# EAGLE design Zio LRA Eval Board V1.0 (EAGLE 9.1.1)
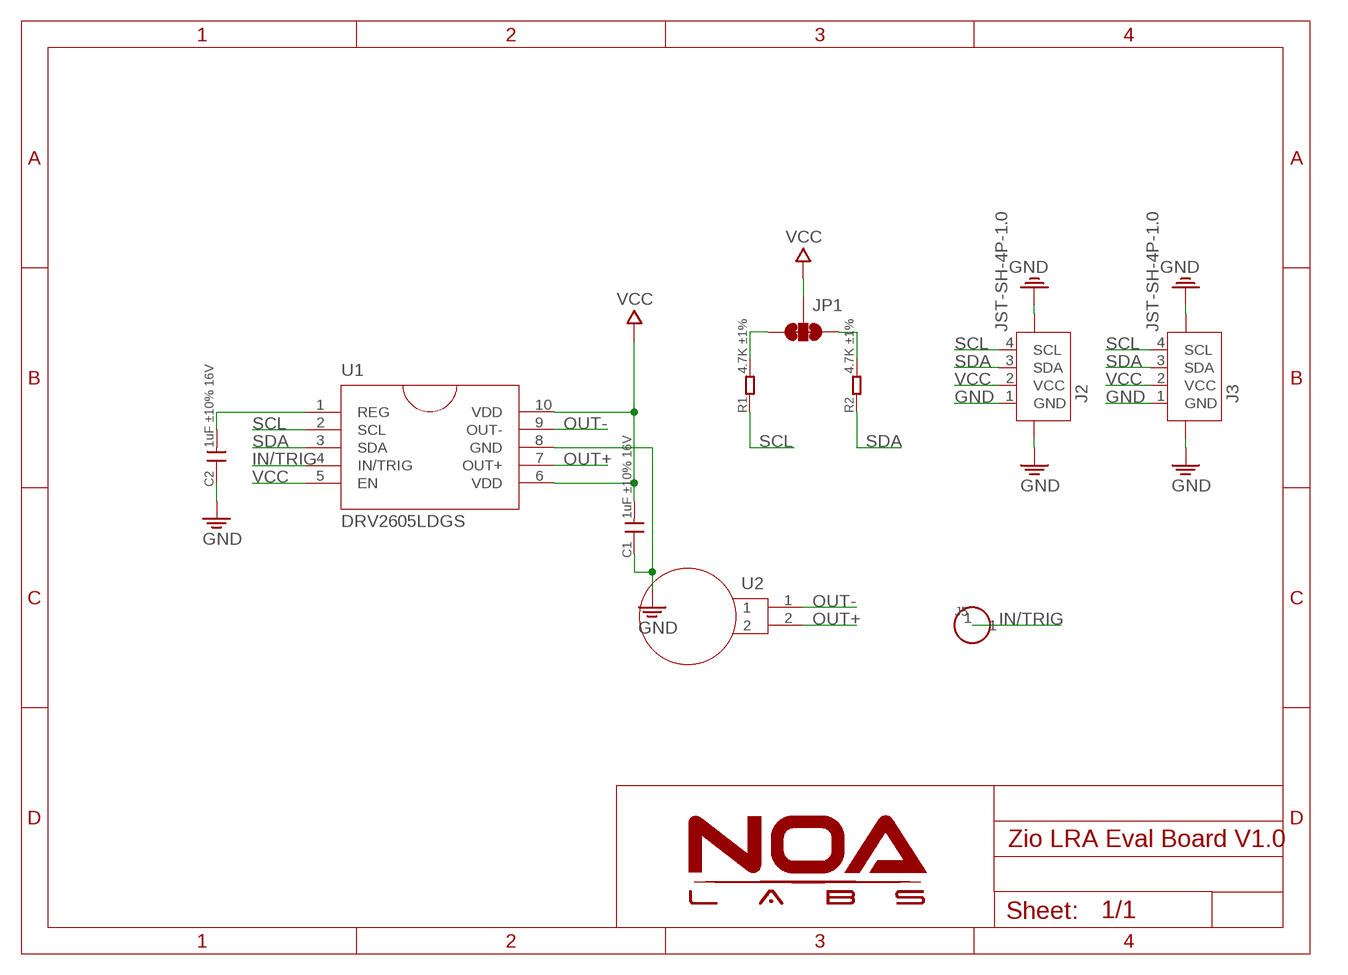
[diagram p0: schematic, sheet 1]

## Parts
C1  1uF ±10% 16V  C-0603  [C0603]
C2  1uF ±10% 16V  C-0603  [C0603]
J2  JST-SH-4P-1.0  [JST-SH-4P]
J3  JST-SH-4P-1.0  [JST-SH-4P]
J5  HEADER-1P  [1P-40MIL]
JP1  SMT-JUMPER_3_2-NC_TRACE  [SMT-JUMPER_3_2-NC_TRACE]
R1  4.7K ±1%  R-0402  [R0402]
R2  4.7K ±1%  R-0402  [R0402]
U1  DRV2605LDGS  DRV2605L  [VSSOP10]
U2  LRA-MOTOR-081230B  [LRA-MOTOR-081230B]

## Nets
GND: C1.1 C2.1 J2.1(GND) J2.NC1 J2.NC2 J3.1(GND) J3.NC1 J3.NC2 U1.8(GND)
IN/TRIG: J5.1 U1.4(IN/TRIG)
N$3: C2.2 U1.1(REG)
N$6: JP1.3 R1.2
N$8: JP1.1 R2.2
OUT+: U1.7(OUT+) U2.2
OUT-: U1.9(OUT-) U2.1
SCL: J2.4(SCL) J3.4(SCL) R1.1 U1.2(SCL)
SDA: J2.3(SDA) J3.3(SDA) R2.1 U1.3(SDA)
VCC: C1.2 J2.2(VCC) J3.2(VCC) JP1.2 U1.5(EN) U1.6(VDD) U1.10(VDD)

## Library data of the parts
C1 C2 = RCL:C
J2 J3 = Connector:JST-SH-4P
J5 = Connector_NOA:HEADER-1P
JP1 = NOA-Jumpers:SMT-JUMPER_3_2-NC_TRACE
R1 R2 = RCL:R
U1 = IC:DRV2605L
U2 = Discretex:LRA-MOTOR-081230B

## Board
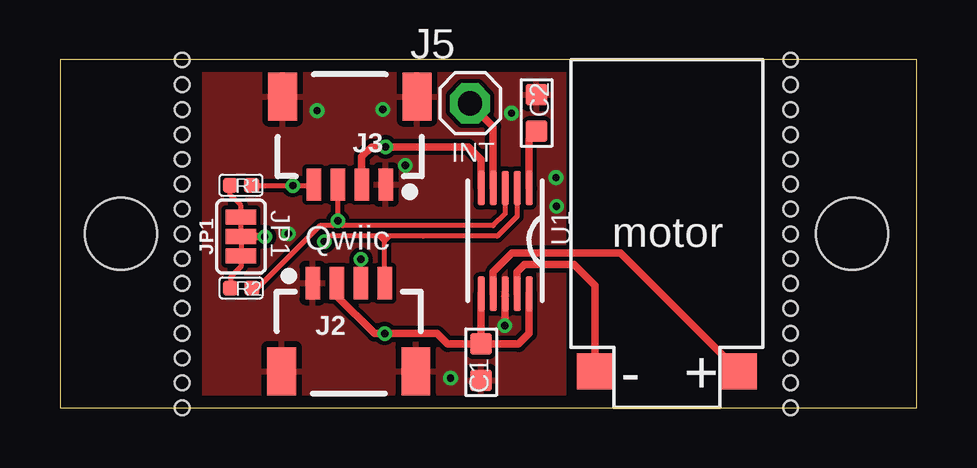
[diagram p1: board, top side]
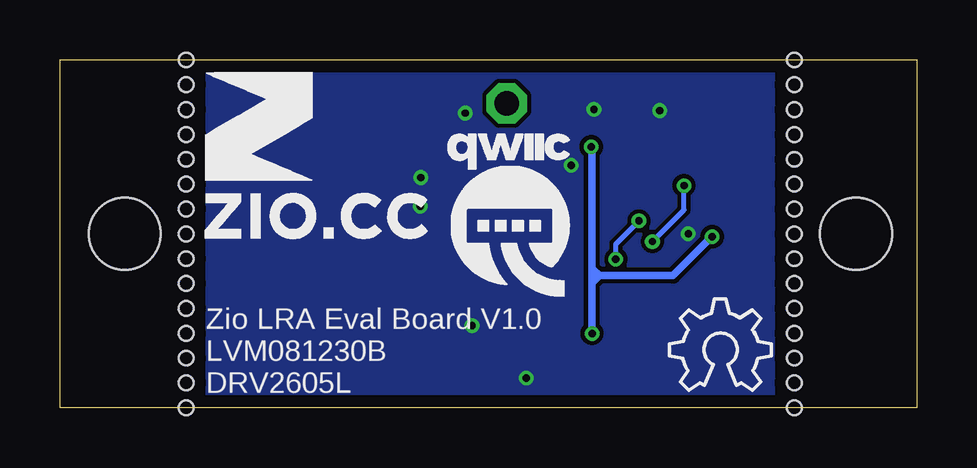
[diagram p2: board, bottom side, seen from below]

Size 35.72 x 14.51 mm. Coordinates in mm from the lower left corner, seen from the top.
Outline: 0,0 35.72,0 35.72,14.51 0,14.51 0,0
Copper layers (1*16): Top 0.035mm / dielectric 1.5mm / Bottom 0.035mm
Design rules "NOA Eagle Rule": minimum track width 7mil, minimum drill 12mil, track to track 7mil, track to pad 7mil, pad to pad 7mil, via to via 7mil, smd to smd 0mil, copper to edge 20mil, drill to drill 10mil, minimum pad ring 10mil, minimum via ring 6mil, stop-mask expansion 2mil, vias tented up to drill 25mil, thermal gap 10mil
Holes 3 mm at 2.54,7.25 33.02,7.25
Holes 0.6 mm at 5.1,0 30.46,0 5.1,1.04 5.1,2.07 5.1,3.11 5.1,4.15 5.1,5.18 5.1,6.22 5.1,7.25 5.1,8.29 5.1,9.33 5.1,10.36 5.1,11.4 5.1,12.44 5.1,13.47 5.1,14.51 30.46,1.04 30.46,2.07 30.46,3.11 30.46,4.15 30.46,5.18 30.46,6.22 30.46,7.25 30.46,8.29 30.46,9.33 30.46,10.36 30.46,11.4 30.46,12.44 30.46,13.47 30.46,14.51

### Footprints (pad centres in the part's own frame; a part is rotated, then mirrored left to right if it is on the bottom)
C0603 = smd 0.889 x 0.889: 1 -0.762,0; 2 0.762,0
JST-SH-4P = smd 0.6 x 1.35: 1 1.5,0; 2 0.5,0; 3 -0.5,0; 4 -1.5,0 | smd 1.2 x 2: NC1 -2.8,3.675; NC2 2.8,3.675
1P-40MIL = drill 1.016 pad 1.676 octagon: 1 0,0
SMT-JUMPER_3_2-NC_TRACE = smd 0.635 x 1.27: 1 -0.813,0; 2 0,0; 3 0.813,0
R0402 = smd 0.635 x 0.635: 1 -0.445,0; 2 0.445,0
VSSOP10 = smd 0.3 x 1.45: 1 -1,-2.2; 2 -0.5,-2.2; 3 0,-2.2; 4 0.5,-2.2; 5 1,-2.2; 6 1,2.2; 7 0.5,2.2; 8 0,2.2; 9 -0.5,2.2; 10 -1,2.2
LRA-MOTOR-081230B = smd 1.5 x 1.5: 1 0,3; 2 0,-3

### Placement (x,y rotation side)
C1  17.56,1.9 90 top
C2  19.87,12.3 270 top
J2  12.04,5.2 180 top
J3  12.08,9.31 0 top
J5  17.09,12.7 0 top
JP1  7.54,7.14 90 top
R1  7.54,9.29 180 top
R2  7.55,5 180 top
U1  18.56,6.96 180 top
U2  25.3,1.51 90 top
U$1  [7MM]  29.69,7.08 0 bottom
U$2  [OSHW_6X150_NOTEXT]  10.31,0.74 0 bottom
U$5  [QWIIC-LOGO-MEDIUM]  17.02,8.1 0 bottom

### Tracks (layer width: path | path; a pad name or v marks a point on that pad's centre or on a via)
GND  (via drill 0.3)
  Top 0.305: U1.8 18.56,3.43 v18.54,3.43
  other vias: 20.68,9.6 20.7,8.41 9.53,7.26 14.4,10.11 13.46,12.45 10.72,12.4 16.28,1.24 18.82,12.29
  pour Top: 6,14.51 21,14.51 21,0 6,0
  pour Bottom: 6,0 6,14.51 29.56,14.51 29.56,0
IN/TRIG
  Top 0.305: J5.1 18.06,11.74 U1.4
N$3
  Top 0.305: U1.1 19.56,11.22 C2.2
N$6
  Top 0.203: JP1.3 7.54,8.43 7.1,8.88 R1.2
N$8
  Top 0.203: JP1.1 7.54,5.89 7.11,5.46 R2.2
OUT+
  Top 0.305: U1.7 18.06,5.66 18.85,6.45 23.37,6.45 U2.2
OUT-
  Top 0.305: U1.9 19.06,5.67 19.36,5.97 21.43,5.97 22.3,5.1 U2.1
SCL  (via drill 0.3)
  Top 0.203: R1.1 8.01,9.27 v9.7,9.27 10.54,9.27 J3.4 | U1.2 19.06,7.98 18.24,7.16 15.14,7.16 13.74,7.16 | 13.74,7.16 13.31,7.16 | 13.31,7.16 11.25,7.16 v11.02,6.93 | J2.4 13.54,6.96 | 13.54,6.96 13.74,7.16 | 13.54,6.96 13.33,7.16 13.31,7.16
  Bottom 0.203: v11.02,6.93 9.7,8.25 v9.7,9.27
SDA  (via drill 0.3)
  Top 0.203: R2.1 8.25,5 10.85,7.59 11.38,7.59 | U1.3 18.56,8.09 18.06,7.59 11.79,7.59 | 11.79,7.59 11.38,7.59 | J3.3 v11.58,7.8 | v11.58,7.8 11.79,7.59 | v11.58,7.8 11.38,7.59 | J2.3 12.54,6.19 v12.55,6.2
  Bottom 0.203: v12.55,6.2 12.55,6.83 v11.58,7.8
VCC  (via drill 0.3)
  Top 0.305: J2.2 11.54,4.67 13.11,3.1 v13.54,3.1 15.72,3.1 16.16,2.66 C1.2 | C1.2 U1.6 | U1.5 17.56,10.36 17.03,10.88 v13.57,10.88 12.98,10.88 12.58,10.48 J3.2 | JP1.2 v8.53,7.14 | U1.10 19.56,3.1 19.12,2.66 C1.2
  Bottom 0.305: v13.54,3.1 13.54,5.21 | 13.54,5.21 13.54,5.82 | 13.54,5.82 13.54,10.85 v13.57,10.88 | v8.53,7.14 10.16,5.51 13.23,5.51 | 13.23,5.51 13.54,5.82 | 13.23,5.51 13.54,5.21

### Text on the board
tPlace: INT | JP1 | Qwiic | motor | - | +
bPlace: Zio LRA Eval Board V1.0 / LVM081230B / DRV2605L